# EAGLE design driver1 (EAGLE 7.3.0)
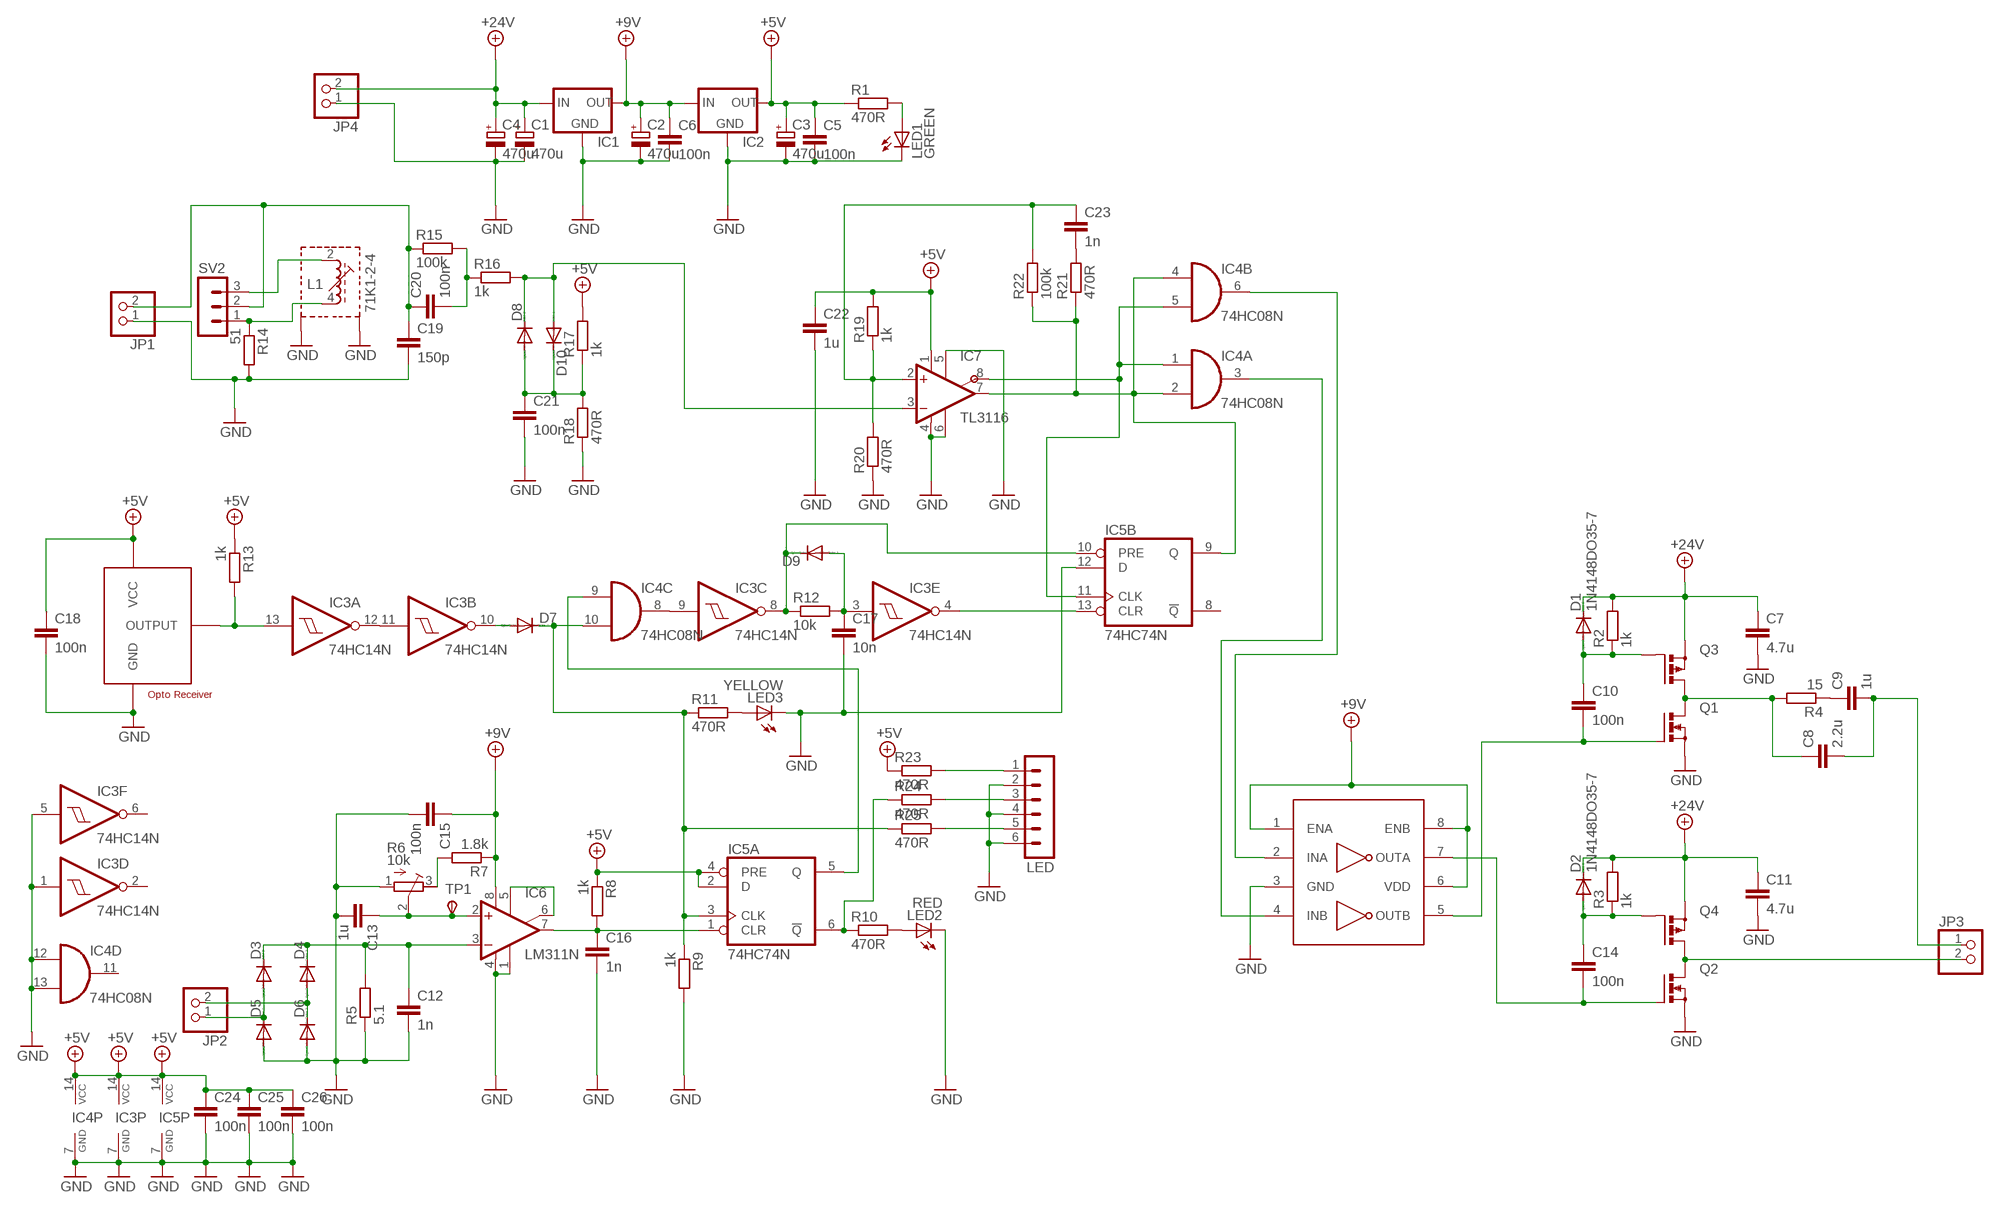
[diagram p0: schematic, sheet 1]

## Parts
C1  470u  CPOL-EUE5-8.5  [E5-8,5]
C2  470u  CPOL-EUE5-8.5  [E5-8,5]
C3  470u  CPOL-EUE5-8.5  [E5-8,5]
C4  470u  CPOL-EUE5-8.5  [E5-8,5]
C5  100n  C-EU025-025X050  [C025-025X050]
C6  100n  C-EU025-025X050  [C025-025X050]
C7  4.7u  C-EU025-025X050  [C025-025X050]
C8  2.2u  C-EU025-025X050  [C025-025X050]
C9  1u  C-EU025-025X050  [C025-025X050]
C10  100n  C-EU025-025X050  [C025-025X050]
C11  4.7u  C-EU025-025X050  [C025-025X050]
C12  1n  C-EU025-025X050  [C025-025X050]
C13  1u  C-EU025-025X050  [C025-025X050]
C14  100n  C-EU025-025X050  [C025-025X050]
C15  100n  C-EU025-025X050  [C025-025X050]
C16  1n  C-EU025-025X050  [C025-025X050]
C17  10n  C-EU025-025X050  [C025-025X050]
C18  100n  C-EU025-025X050  [C025-025X050]
C19  150p  C-EU025-025X050  [C025-025X050]
C20  100n  C-EU025-025X050  [C025-025X050]
C21  100n  C-EU025-025X050  [C025-025X050]
C22  1u  C-EU025-025X050  [C025-025X050]
C23  1n  C-EU025-025X050  [C025-025X050]
C24  100n  C-EU025-025X050  [C025-025X050]
C25  100n  C-EU025-025X050  [C025-025X050]
C26  100n  C-EU025-025X050  [C025-025X050]
D1  1N4148DO35-7  [DO35-7]
D2  1N4148DO35-7  [DO35-7]
D3  DIODE-D-7.5  [D-7.5]
D4  DIODE-D-7.5  [D-7.5]
D5  DIODE-D-7.5  [D-7.5]
D6  DIODE-D-7.5  [D-7.5]
D7  DIODE-D-7.5  [D-7.5]
D8  DIODE-D-7.5  [D-7.5]
D9  DIODE-D-7.5  [D-7.5]
D10  DIODE-D-7.5  [D-7.5]
IC1  78XXS  [78XXS]
IC2  78XXS  [78XXS]
IC3  74HC14N  [DIL14]
IC4  74HC08N  [DIL14]
IC5  74HC74N  [DIL14]
IC6  LM311N  [DIL8]
IC7  TL3116  [DIL8]
IC8  UCC27423  [DIL8]
JP1  PINHD-1X2  [1X02]
JP2  PINHD-1X2  [1X02]
JP3  PINHD-1X2  [1X02]
JP4  PINHD-1X2  [1X02]
L1  71K1-2-4  [71K]
LED  MA06-1  [MA06-1]
LED1  GREEN  LED3MM  [LED3MM]
LED2  RED  LED3MM  [LED3MM]
LED3  YELLOW  LED3MM  [LED3MM]
OP1  IFD95  [OPTO-RECEIVER]
Q1  PMOSFET_NTO220BV  [TO220BV]
Q2  PMOSFET_NTO220BV  [TO220BV]
Q3  PMOSFET_PTO220BV  [TO220BV]
Q4  PMOSFET_PTO220BV  [TO220BV]
R1  470R  R-EU_0207/7  [0207/7]
R2  1k  R-EU_0207/7  [0207/7]
R3  1k  R-EU_0207/7  [0207/7]
R4  15  R-EU_0207/7  [0207/7]
R5  5.1  R-EU_0309/12  [0309/12]
R6  10k  R-TRIMM64W  [RTRIM64W]
R7  1.8k  R-EU_0207/7  [0207/7]
R8  1k  R-EU_0207/7  [0207/7]
R9  1k  R-EU_0207/7  [0207/7]
R10  470R  R-EU_0207/7  [0207/7]
R11  470R  R-EU_0207/7  [0207/7]
R12  10k  R-EU_0207/7  [0207/7]
R13  1k  R-EU_0207/7  [0207/7]
R14  51  R-EU_0309/12  [0309/12]
R15  100k  R-EU_0207/7  [0207/7]
R16  1k  R-EU_0207/7  [0207/7]
R17  1k  R-EU_0207/7  [0207/7]
R18  470R  R-EU_0207/7  [0207/7]
R19  1k  R-EU_0207/7  [0207/7]
R20  470R  R-EU_0207/7  [0207/7]
R21  470R  R-EU_0207/7  [0207/7]
R22  100k  R-EU_0207/7  [0207/7]
R23  470R  R-EU_0207/7  [0207/7]
R24  470R  R-EU_0207/7  [0207/7]
R25  470R  R-EU_0207/7  [0207/7]
SV2  MA03-1  [MA03-1]
TP1  TPSTP20R  [TP20R]

## Nets
+5V: C3.+ C5.1 C18.1 C22.1 C24.1 C25.1 C26.1 IC2.OUT IC3.14(P:VCC) IC4.14(P:VCC) IC5.2(A:D) IC5.4(A:PRE) IC5.14(P:VCC) IC7.1(V+) OP1.P$3(VCC) R1.1 R8.1 R13.1 R17.2 R19.2 R23.1
+9V: C2.+ C6.1 C15.1 IC1.OUT IC2.IN IC6.8(V+) IC8.1(ENA) IC8.6(VDD) IC8.8(ENB) R7.1
+24V: C1.+ C4.+ C7.1 C11.1 D1.C D2.C IC1.IN JP4.2 Q3.S Q4.S R2.2 R3.2
GND: C1.- C2.- C3.- C4.- C5.2 C6.2 C7.2 C11.2 C12.2 C13.2 C15.2 C16.2 C17.2 C18.2 C19.2 C21.2 C22.2 C24.2 C25.2 C26.2 D5.A D6.A IC1.GND IC2.GND IC3.1(D:I) IC3.5(F:I) IC3.7(P:GND) IC4.7(P:GND) IC4.12(D:I0) IC4.13(D:I1) IC5.7(P:GND) IC5.12(B:D) IC6.1(GND) IC6.4(V-) IC7.4(V-) IC7.5(LEN) IC7.6(GND) IC8.3(GND) JP1.1 JP4.1 L1.S1 L1.S2 LED1.K(C) LED2.K(C) LED3.K(C) LED.2 LED.4 LED.6 OP1.P$1(GND) Q1.S Q2.S R5.1 R6.1(A) R9.2 R14.2 R18.1 R20.1
N$1: IC3.11(B:I) IC3.12(A:O)
N$2: LED1.A R1.2
N$3: IC3.9(C:I) IC4.8(C:O)
N$4: C8.1 Q1.D Q3.D R4.2
N$5: IC6.5(ON) IC6.6(ON/STR)
N$6: C10.1 D1.A Q3.G R2.1
N$7: IC4.2(A:I1) IC4.4(B:I0) IC5.9(B:Q) IC7.7(OUT) R21.1 R22.1
N$8: C9.1 R4.1
N$9: C8.2 C9.2 JP3.1
N$10: C14.1 D2.A Q4.G R3.1
N$11: IC4.6(B:O) IC8.2(INA)
N$12: JP3.2 Q2.D Q4.D
N$13: C16.1 IC5.1(A:CLR) IC6.7(OUT) R8.2
N$14: R6.3(E) R7.2
N$15: LED.1 R23.2
N$16: LED.3 R24.2
N$17: IC4.3(A:O) IC8.4(INB)
N$18: LED.5 R25.2
N$19: C13.1 IC6.2(+IN) R6.2(S) TP1.TP(PP)
N$20: C12.1 D3.C D4.C IC6.3(-IN) R5.2
N$22: D9.C IC3.8(C:O) IC5.10(B:PRE) R12.1
N$23: D3.A D5.C JP2.1
N$24: D4.A D6.C JP2.2
N$25: D7.C IC4.10(C:I1) IC5.3(A:CLK) R9.1 R11.1 R25.1
N$26: IC3.13(A:I) OP1.P$2(OUTPUT) R13.2
N$27: D7.A IC3.10(B:O)
N$28: IC5.6(A:!Q) R10.1 R24.1
N$29: LED2.A R10.2
N$30: LED3.A R11.2
N$31: IC4.9(C:I0) IC5.5(A:Q)
N$32: C17.1 D9.A IC3.3(E:I) R12.2
N$33: IC3.4(E:O) IC5.13(B:CLR)
N$34: IC4.1(A:I0) IC4.5(B:I1) IC5.11(B:CLK) IC7.8(!OUT)
N$35: C19.1 C20.1 JP1.2 R15.1 SV2.2
N$36: C14.2 IC8.7(OUTA) Q2.G
N$37: C20.2 R15.2 R16.1
N$38: L1.4(E) R14.1 SV2.1
N$39: L1.2(A) SV2.3
N$40: D8.C D10.A IC7.3(-IN) R16.2
N$41: C21.1 D8.A D10.C R17.1 R18.2
N$42: C10.2 IC8.5(OUTB) Q1.G
N$46: C23.2 R21.2
N$47: C23.1 IC7.2(+IN) R19.1 R20.2 R22.2
Unconnected: IC3.2(D:O) IC3.6(F:O) IC4.11(D:O) IC5.8(B:!Q)

## Library data of the parts
C1-C4 = rcl:CPOL-EU: POLARIZED CAPACITOR, European symbol
C5-C26 = rcl:C-EU: CAPACITOR, European symbol
D1 D2 = diode:1N4148: DIODE high speed (Philips)
D3-D10 = diode:DIODE-: DIODE
IC1 IC2 = v-reg:78XXS: VOLTAGE REGULATOR
IC3 = 74xx-eu:74*14: Hex schmitt trigger INVERTER
IC4 = 74xx-eu:74*08: Quad 2-input AND gate
IC5 = 74xx-eu:74*74: Dual D type positive edge triggered FLIP FLOP, preset and clear
IC6 = driver:LM311N
IC7 = driver:TL3116
IC8 = driver:UCC27423
JP1-JP4 = pinhead:PINHD-1X2: PIN HEADER
L1 = UD27:71K1-: FILTER adjustable filter coil, type K; OC_FARNELL: unknown; OC_NEWARK: unknown
LED = con-lstb:MA06-1: PIN HEADER; OC_FARNELL: unknown; OC_NEWARK: unknown
LED1-LED3 = led:LED: LED OSRAM: - CHIPLED LG R971, LG N971, LY N971, LG Q971, LY Q971, LO R971, LY R971 LH N974, LH R974 LS Q976, LO Q976, LY Q976 LO Q996 - Hyper CHIPLED LW Q18S LB Q993, LB Q99A, LB R99A - SideLED LS A670, LO A670, LY A670, LG A670, LP A670 LB A673, LV A673, LT A673, LW A673 LH A674 LY A675 LS A676, LA A676, LO A676, LY A676, LW A676 LS A679, LY A679, LG A679 - Hyper Micro SIDELED® LS Y876, LA Y876, LO Y876, LY Y876 LT Y87S - SmartLED LW L88C, LW L88S LB L89C, LB L89S, LG L890 LS L89K, LO L89K, LY L89K LS L896, LA L896, LO L896, LY L896 - TOPLED LS T670, LO T670, LY T670, LG T670, LP T670 LSG T670, LSP T670, LSY T670, LOP T670, LYG T670 LG T671, LOG T671, LSG T671 LB T673, LV T673, LT T673, LW T673 LH T674 LS T676, LA T676, LO T676, LY T676, LB T676, LH T676, LSB T676, LW T676 LB T67C, LV T67C, LT T67C, LS T67K, LO T67K, LY T67K, LW E67C LS E67B, LA E67B, LO E67B, LY E67B, LB E67C, LV E67C, LT E67C LW T67C LS T679, LY T679, LG T679 LS T770, LO T770, LY T770, LG T770, LP T770 LB T773, LV T773, LT T773, LW T773 LH T774 LS E675, LA E675, LY E675, LS T675 LS T776, LA T776, LO T776, LY T776, LB T776 LHGB T686 LT T68C, LB T68C - Hyper Mini TOPLED® LB M676 - Mini TOPLED Santana® LG M470 LS M47K, LO M47K, LY M47K Source: http://www.osram.convergy.de LUXEON: - LUMILED® LXK2-PW12-R00, LXK2-PW12-S00, LXK2-PW14-U00, LXK2-PW14-V00 LXK2-PM12-R00, LXK2-PM12-S00, LXK2-PM14-U00 LXK2-PE12-Q00, LXK2-PE12-R00, LXK2-PE12-S00, LXK2-PE14-T00, LXK2-PE14-U00 LXK2-PB12-K00, LXK2-PB12-L00, LXK2-PB12-M00, LXK2-PB14-N00, LXK2-PB14-P00, LXK2-PB14-Q00 LXK2-PR12-L00, LXK2-PR12-M00, LXK2-PR14-Q00, LXK2-PR14-R00 LXK2-PD12-Q00, LXK2-PD12-R00, LXK2-PD12-S00 LXK2-PH12-R00, LXK2-PH12-S00 LXK2-PL12-P00, LXK2-PL12-Q00, LXK2-PL12-R00 Source: www.luxeon.com KINGBRIGHT: KA-3528ASYC Source: www.kingbright.com
OP1 = BillPorter:IFD95: IF-D95T Photologic Detector with Totem-Pole Output. Fiber Optic Receiver with push-pull output. May also work with IF-D97 and IF-D98 receivers. Spec sheet @ http://www.i-fiberoptics.com/pdf/IFD95.pdf
Q1 Q2 = transistor-power:PMOSFET_N: Power MOSFET N-Channel
Q3 Q4 = transistor-power:PMOSFET_P: Power MOSFET P-Channel
R1-R5 R7-R25 = rcl:R-EU_: RESISTOR, European symbol
R6 = rcl:R-TRIMM: Trimm resistor
SV2 = con-lstb:MA03-1: PIN HEADER; OC_FARNELL: unknown; OC_NEWARK: unknown
TP1 = testpad:TPS: TEST PIN

## Board
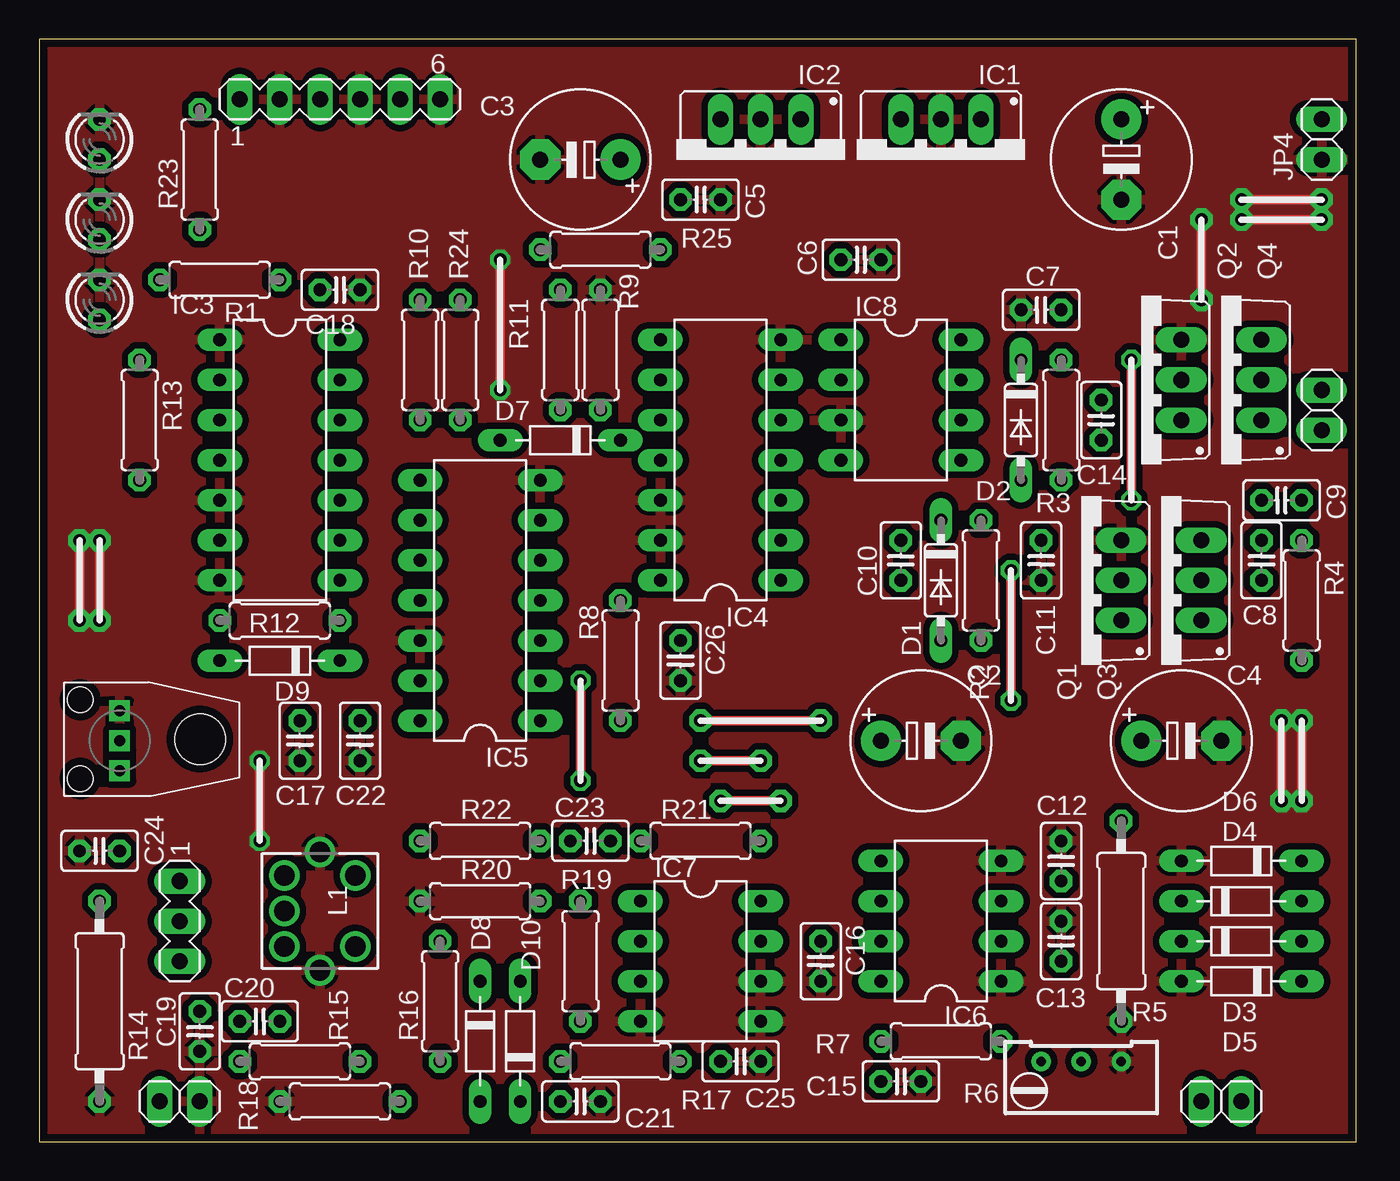
[diagram p1: board, top side]
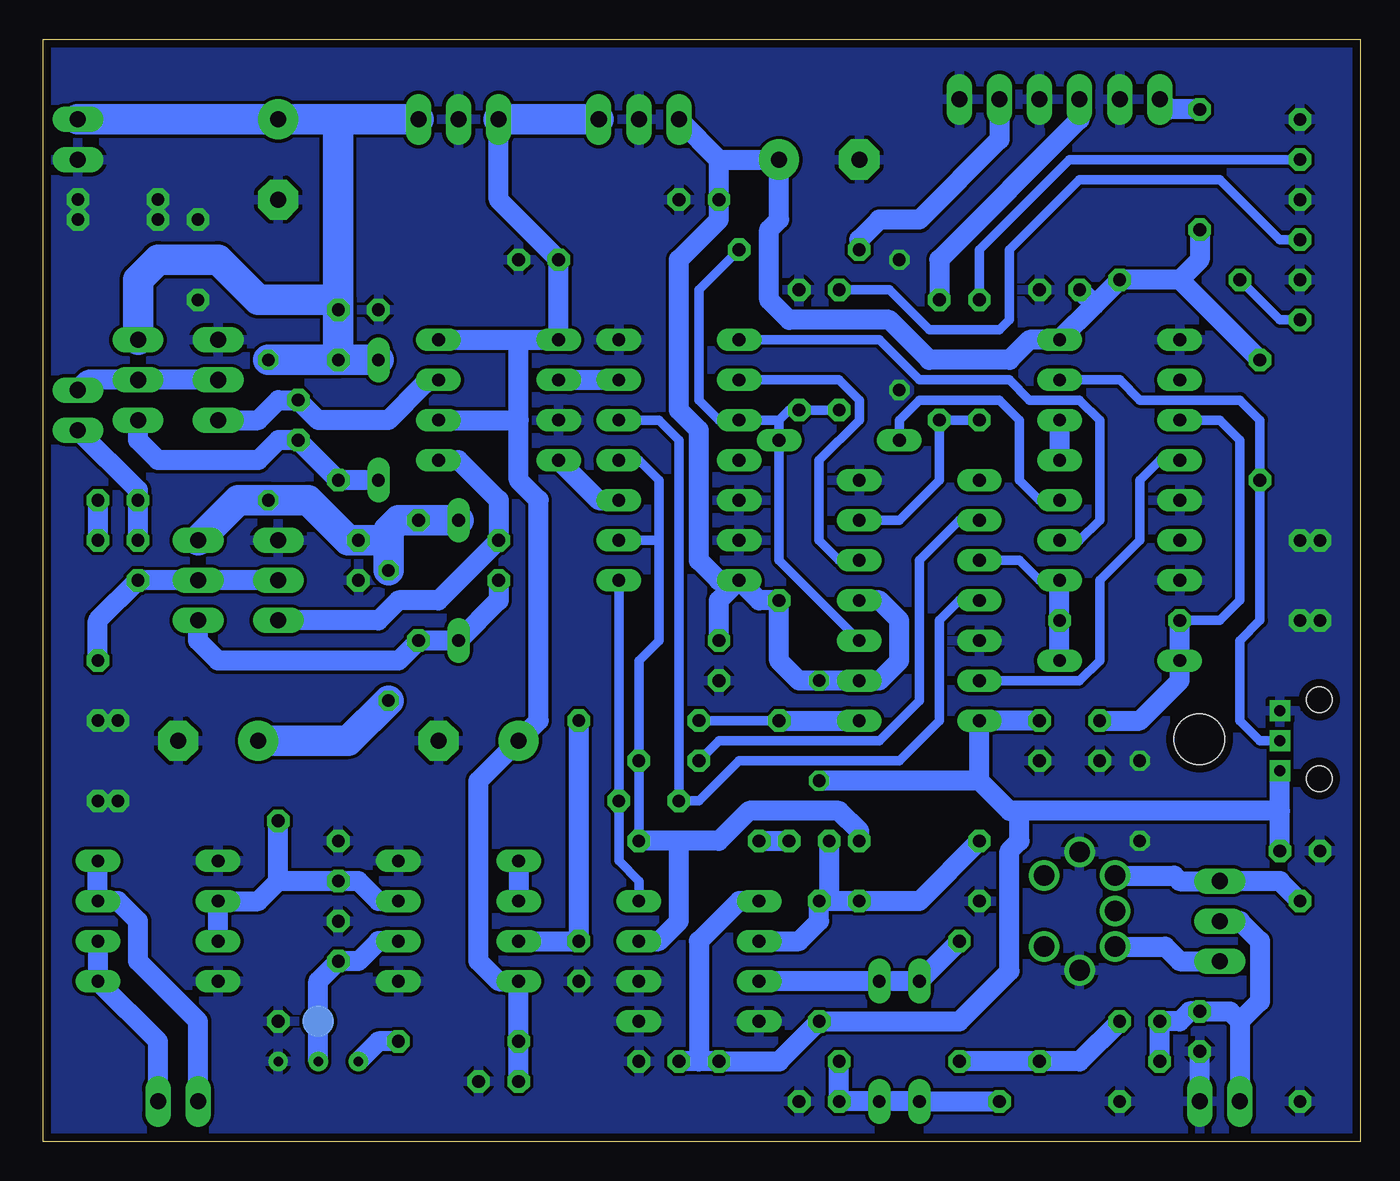
[diagram p2: board, bottom side, seen from below]

Size 83.49 x 69.84 mm. Coordinates in mm from the lower left corner, seen from the top.
Outline: 0,0 83.49,0 83.49,69.84 0,69.84 0,0
Copper layers (1*16): Top 0.035mm / dielectric 1.5mm / Bottom 0.035mm
Design rules "default *": minimum track width 10mil, minimum drill 24mil, track to track 8mil, track to pad 8mil, pad to pad 8mil, via to via 8mil, smd to smd 8mil, copper to edge 20mil, drill to drill 8mil, minimum pad ring 12mil, minimum via ring 8mil, stop-mask expansion 4mil, vias tented up to drill 0mil, thermal gap 10mil

### Footprints (pad centres in the part's own frame; a part is rotated, then mirrored left to right if it is on the bottom)
E5-8,5 = drill 1.016 pad 2.54: + -2.54,0 | drill 1.016 pad 2.54 octagon: - 2.54,0
C025-025X050 = drill 0.813 octagon: 1 -1.27,0; 2 1.27,0
DO35-7 = drill 0.813 long: A 3.81,0; C -3.81,0
D-7.5 = drill 0.813 long: A 3.81,0; C -3.81,0
78XXS = drill 1.016 long: GND 0,-2.54; IN -2.54,-2.54; OUT 2.54,-2.54
DIL14 = drill 0.813 long: 1 -7.62,-3.81; 2 -5.08,-3.81; 3 -2.54,-3.81; 4 0,-3.81; 5 2.54,-3.81; 6 5.08,-3.81; 7 7.62,-3.81; 8 7.62,3.81; 9 5.08,3.81; 10 2.54,3.81; 11 0,3.81; 12 -2.54,3.81; 13 -5.08,3.81; 14 -7.62,3.81
DIL8 = drill 0.813 long: 1 -3.81,-3.81; 2 -1.27,-3.81; 3 1.27,-3.81; 4 3.81,-3.81; 5 3.81,3.81; 6 1.27,3.81; 7 -1.27,3.81; 8 -3.81,3.81
1X02 = drill 1.016 long: 1 -1.27,0; 2 1.27,0
71K = drill 1.3: 1 -2.25,-2.25; 2 -2.25,2.25; 3 0,2.25; 4 2.25,2.25; 5 2.25,-2.25; S1 -3.75,0; S2 3.75,0
MA06-1 = drill 1.016 long: 1 -6.35,0; 2 -3.81,0; 3 -1.27,0; 4 1.27,0; 5 3.81,0; 6 6.35,0
LED3MM = drill 0.813 octagon: A -1.27,0; K 1.27,0
OPTO-RECEIVER = drill 0.7 square: P$1 1.9,0; P$2 0,0; P$3 -1.9,0 | hole 1.6: -2.4,2.5; 2.6,2.5 | hole 3.2: 0.1,-5.1
TO220BV = drill 1.016 long: D 0,-2.54; G -2.54,-2.54; S 2.54,-2.54
0207/7 = drill 0.813 octagon: 1 -3.81,0; 2 3.81,0
0309/12 = drill 0.813 octagon: 1 -6.35,0; 2 6.35,0
RTRIM64W = drill 0.61: 1 1.27,-2.54; 2 1.27,0; 3 1.27,2.54
MA03-1 = drill 1.016 long: 1 -2.54,0; 2 0,0; 3 2.54,0
TP20R = smd 2 x 2: TP 0,0

### Placement (x,y rotation side)
C1  68.58,62.23 270 top
C2  55.88,25.4 0 top
C3  34.29,62.23 180 top
C4  72.39,25.4 0 top
C5  41.91,59.69 0 top
C6  52.07,55.88 0 top
C7  63.5,52.7 180 top
C8  77.47,36.83 90 top
C9  78.74,40.64 180 top
C10  54.61,36.83 90 top
C11  63.5,36.83 270 top
C12  64.77,17.78 90 top
C13  64.77,12.7 90 top
C14  67.31,45.72 90 top
C15  54.61,3.81 0 top
C16  49.53,11.43 270 top
C17  16.51,25.4 270 top
C18  19.05,53.98 0 top
C19  10.16,6.99 270 top
C20  13.97,7.62 0 top
C21  34.29,2.54 0 top
C22  20.32,25.4 270 top
C23  34.92,19.05 0 top
C24  3.81,18.41 180 top
C25  44.45,5.08 0 top
C26  40.64,30.48 270 top
D1  57.15,35.56 270 top
D2  62.23,45.72 270 top
D3  76.2,12.7 0 top
D4  76.2,15.24 0 top
D5  76.2,10.16 180 top
D6  76.2,17.78 180 top
D7  33.02,44.45 180 top
D8  27.94,6.35 270 top
D9  15.24,30.48 180 top
D10  30.48,6.35 90 top
IC1  57.15,62.23 180 top
IC2  45.72,62.23 180 top
IC3  15.24,43.18 270 top
IC4  43.18,43.18 90 top
IC5  27.94,34.29 90 top
IC6  57.15,13.97 90 top
IC7  41.91,11.43 270 top
IC8  54.61,46.99 270 top
JP1  8.89,2.54 180 top
JP2  74.93,2.54 180 top
JP3  81.28,46.35 90 top
JP4  81.28,63.5 90 top
L1  17.78,14.61 90 top
LED  19.05,66.04 0 top
LED1  3.81,53.34 90 top
LED2  3.81,63.5 90 top
LED3  3.81,58.42 90 top
OP1  5.08,25.4 90 top
Q1  66.04,35.56 90 top
Q2  69.85,48.26 90 top
Q3  71.12,35.56 90 top
Q4  74.93,48.26 90 top
R1  11.43,54.61 180 top
R2  59.69,35.56 90 top
R3  64.77,45.72 90 top
R4  80.01,34.29 270 top
R5  68.58,13.97 90 top
R6  66.04,3.81 90 top
R7  57.15,6.35 0 top
R8  36.83,30.48 270 top
R9  35.56,50.16 90 top
R10  24.13,49.53 90 top
R11  33.02,50.16 90 top
R12  15.24,33.02 180 top
R13  6.35,45.72 270 top
R14  3.81,8.89 270 top
R15  16.51,5.08 0 top
R16  25.4,8.89 90 top
R17  36.83,5.08 0 top
R18  19.05,2.54 0 top
R19  34.29,11.43 270 top
R20  27.94,15.24 0 top
R21  41.91,19.05 180 top
R22  27.94,19.05 180 top
R23  10.16,61.59 90 top
R24  26.67,49.53 90 top
R25  35.56,56.52 180 top
SV2  8.89,13.97 270 top
TP1  66.04,7.62 0 bottom

### Tracks (layer width: path | path; a pad name or v marks a point on that pad's centre or on a via)
+5V  (via drill 0.8 pad 1.27)
  Top 0.61: v34.29,22.86 v34.29,29.21
  Bottom 1.27: IC4.14 38.1,34.29 R8.1 36.83,30.48 35.56,29.21 v34.29,29.21 IC5.2 30.48,29.21 29.21,30.48 29.21,33.02 30.48,34.29 IC5.4 | 24.13,22.86 v34.29,22.86 | IC2.OUT 40.64,62.23 | 40.64,62.23 C3.+ 36.83,58.42 37.47,57.78 37.47,53.34 36.2,52.07 29.84,52.07 27.3,49.53 22.23,49.53 20.95,50.8 IC3.14 16.83,53.02 | 40.64,62.23 C5.1 40.64,58.42 43.18,55.88 43.18,46.35 41.91,45.09 41.91,36.83 40.64,35.56 IC4.14 | 24.13,22.86 IC5.14 C22.1 | 21.59,20.95 21.59,19.05 22.23,18.41 22.23,10.79 25.4,7.62 R19.2 36.83,5.08 R17.2 41.91,5.08 | 41.91,5.08 C25.1 | 5.08,20.95 21.59,20.95 | C24.1 5.08,20.95 | 21.59,20.95 22.23,20.95 24.13,22.86 | 16.83,53.02 R1.1 11.43,54.61 | R13.1 11.43,54.61 | R23.1 10.16,55.88 11.43,54.61 | C18.1 16.83,53.02 | C26.1 40.64,34.29 IC4.14 | 41.91,5.08 41.91,12.7 39.37,15.24 IC7.1 | 5.08,20.95 OP1.P$3
+9V
  Bottom 1.27: C15.1 R7.1 IC6.8 54.61,10.16 55.88,11.43 55.88,22.86 C2.+ 52.07,26.67 52.07,40.64 53.34,41.91 53.34,45.72 | IC1.OUT 54.61,59.69 C6.1 IC8.1 53.34,50.8 | 53.34,45.72 53.34,50.8 | IC8.6 53.34,45.72 | IC8.8 53.34,50.8
  Bottom 1.93: IC1.OUT IC2.IN
+24V  (via drill 0.8 pad 1.27)
  Top 0.61: v69.22,40.64 v69.22,49.53 | v61.59,27.94 v61.59,36.2
  Bottom 1.93: Q4.S 77.47,54.61 76.2,55.88 72.39,55.88 69.85,53.34 64.77,53.34 | R3.2 C7.1 64.77,53.34 | D2.C R3.2 | v69.22,49.53 R3.2 | v61.59,27.94 64.14,25.4 C4.+ | JP4.2 C1.+ 64.77,64.77 | IC1.IN 64.77,64.77 | 64.77,53.34 64.77,64.77 | D1.C R2.2 60.96,39.37 61.59,38.73 61.59,38.1 | v61.59,36.2 61.59,38.1 | 61.59,38.1 C11.1 64.14,38.1 66.67,40.64 v69.22,40.64 71.12,40.64 Q3.S
GND  (via drill 0.8 pad 1.27, 0.8 pad 1.42)
  Top 0.61: v73.66,53.34 v73.66,58.42 | v13.97,24.13 v13.97,19.05 | v29.21,47.62 v29.21,55.88 | v81.28,58.42 v76.2,58.42 | v81.28,59.69 v76.2,59.69 | v80.01,26.67 v80.01,21.59 | v78.74,26.67 v78.74,21.59 | v3.81,38.1 v3.81,33.02 | v2.54,38.1 v2.54,33.02
  Bottom 1.27: JP1.1 C19.2
  pour Bottom: 0,0 83.82,0 83.82,69.85 0,69.85
  pour Top (isolate 0.406): 0,0 83.82,0 83.82,69.85 0,69.85
N$1
  Bottom 1.27: IC3.12 IC3.11
N$2
  Bottom 0.61: LED1.A 5.08,52.07 R1.2
N$3
  Bottom 0.61: IC4.8 30.48,50.8 27.94,48.26 22.23,48.26 20.95,46.99 17.78,46.99 16.51,45.72 16.51,39.37 17.78,38.1 IC3.9
N$4
  Bottom 1.27: Q1.D Q3.D C8.1 80.01,33.02 R4.2
N$5
  Bottom 1.27: IC6.5 IC6.6
N$6
  Bottom 1.27: C10.1 54.61,34.29 D1.A R2.1 60.96,30.48 72.39,30.48 73.66,31.75 Q3.G
N$7  (via drill 0.8 pad 1.42)
  Top 0.61: v41.91,24.13 v45.72,24.13
  Bottom 0.61: 44.45,38.1 IC4.2 | IC4.4 45.72,43.18 44.45,41.91 44.45,38.1 | IC5.9 25.4,39.37 27.94,36.83 27.94,27.94 30.48,25.4 40.64,25.4 v41.91,24.13 | R21.1 v45.72,24.13 45.72,30.48 44.45,31.75 44.45,38.1
  Bottom 1.27: 43.18,19.05 43.18,13.97 44.45,12.7 IC7.7 | 43.18,19.05 R21.1 | R22.1 31.75,19.68 33.02,20.95 38.73,20.95 40.64,19.05 43.18,19.05
N$8
  Bottom 1.27: C9.1 R4.1
N$9
  Bottom 1.27: C8.2 C9.2 77.47,41.27 JP3.1
N$10
  Bottom 1.27: D2.A R3.1 C14.1 68.58,44.45 69.85,43.18 76.2,43.18 77.47,44.45 Q4.G
N$11
  Bottom 1.27: IC8.2 IC4.6
N$12
  Bottom 1.27: Q2.D Q4.D 80.64,48.26 JP3.2
N$13  (via drill 0.8 pad 1.42)
  Top 0.61: v41.91,26.67 v49.53,26.67
  Bottom 0.61: R8.2 v41.91,26.67
  Bottom 1.27: R8.2 IC5.1 | v49.53,26.67 C16.1 IC6.7
N$14
  Bottom 1.27: R7.2 62.23,6.35 R6.3
N$15
  Bottom 1.27: R23.2 12.06,65.41 LED.1
N$16
  Bottom 1.27: LED.3 17.78,64.77 26.67,55.88 R24.2
N$17
  Bottom 1.27: IC4.3 48.26,40.64 IC8.4
N$18
  Bottom 1.27: LED.5 22.86,63.5 27.94,58.42 30.48,58.42 31.75,57.15 R25.2
N$19
  Bottom 1.27: R6.2 TP1.TP 66.04,10.16 C13.1 63.5,11.43 62.23,12.7 IC6.2
N$20
  Bottom 1.27: D3.C D4.C 69.85,15.24 68.58,16.51 | 68.58,16.51 R5.2 | 68.58,16.51 C12.1 63.5,16.51 62.23,15.24 IC6.3
N$22
  Bottom 0.61: IC3.8 20.32,35.56 21.59,36.83 IC5.10
  Bottom 1.27: D9.C R12.1 IC3.8
N$23
  Bottom 1.27: D3.A D5.C 76.2,6.35 JP2.1
N$24
  Bottom 1.27: D6.C D4.A 78.74,15.24 77.47,13.97 77.47,11.43 73.66,7.62 JP2.2
N$25
  Bottom 0.61: R11.1 R9.1 36.2,46.35 36.83,45.72 | IC5.3 36.83,36.83 D7.C 36.83,45.72 | R25.1 41.91,53.98 41.91,46.99 40.64,45.72 IC4.10 36.83,45.72
N$26
  Bottom 0.61: IC3.13 15.24,48.26 13.97,46.99 7.62,46.99 6.35,45.72 R13.2 6.35,33.02 7.62,31.75 7.62,26.67 6.35,25.4 OP1.P$2
N$27
  Bottom 0.61: IC3.10 20.32,40.64 21.59,41.91 21.59,45.72 22.86,46.99 27.94,46.99 29.21,45.72 D7.A
N$28
  Bottom 0.61: R10.1 R24.1 26.67,41.91 29.21,39.37 IC5.6
N$29
  Bottom 0.61: R10.2 24.13,56.52 18.41,62.23 LED2.A
N$30
  Bottom 0.61: R11.2 29.84,53.98 27.3,51.44 22.86,51.44 22.23,52.07 22.23,56.52 17.78,60.96 8.89,60.96 5.08,57.15 LED3.A
N$31
  Bottom 0.61: IC4.9 33.02,48.26 31.75,46.99 31.75,45.72 34.29,43.18 34.29,38.1 33.02,36.83 IC5.5
N$32
  Bottom 0.61: IC3.3 8.89,45.72 7.62,44.45 7.62,34.29 8.89,33.02 R12.2
  Bottom 1.27: R12.2 D9.A 11.43,29.21 13.97,26.67 C17.1
N$33
  Bottom 0.61: IC5.13 17.78,29.21 16.51,30.48 16.51,35.56 13.97,38.1 13.97,41.91 12.7,43.18 IC3.4
N$34  (via drill 0.8 pad 1.42)
  Top 0.61: v43.18,21.59 v46.99,21.59
  Bottom 0.61: IC5.11 25.4,34.29 26.67,33.02 26.67,26.67 29.21,24.13 39.37,24.13 41.91,21.59 v43.18,21.59 | IC4.5 44.45,45.72 43.18,44.45 v43.18,21.59 | IC4.1 v46.99,21.59 46.99,17.78 45.72,16.51 IC7.8 | 43.18,22.86 v43.18,21.59
N$35
  Bottom 1.27: R15.1 C20.1 11.43,7.62 10.79,8.26 C19.1 8.26,8.26 7.62,7.62 | SV2.2 7.62,13.97 6.35,12.7 6.35,8.89 7.62,7.62 | 7.62,7.62 JP1.2
N$36
  Bottom 1.27: Q2.G 69.85,45.72 68.58,46.99 C14.2 66.04,45.72 61.59,45.72 59.37,47.94 59.05,48.26 IC8.7
N$37
  Bottom 1.27: C20.2 17.78,5.08 R15.2 R16.1
N$38
  Bottom 1.27: L1.4 11.78,16.86 11.43,16.51 SV2.1 5.08,16.51 R14.1
N$39
  Bottom 1.27: L1.2 12.36,12.36 11.43,11.43 SV2.3
N$40
  Bottom 1.27: R16.2 D8.C D10.A IC7.3
N$41
  Bottom 1.27: R18.2 D8.A D10.C C21.1 R17.1
N$42
  Bottom 1.27: Q1.G 62.23,33.02 60.96,34.29 58.42,34.29 C10.2 54.61,40.64 57.15,43.18 IC8.5
N$46
  Bottom 1.27: R21.2 C23.2
N$47
  Bottom 1.27: R22.2 27.94,15.24 R20.2 33.66,15.24 | 33.66,15.24 R19.1 34.29,13.97 35.56,12.7 IC7.2 | C23.1 33.66,15.24